# EAGLE design Reaccion-vRegvC (EAGLE 7.4.0)
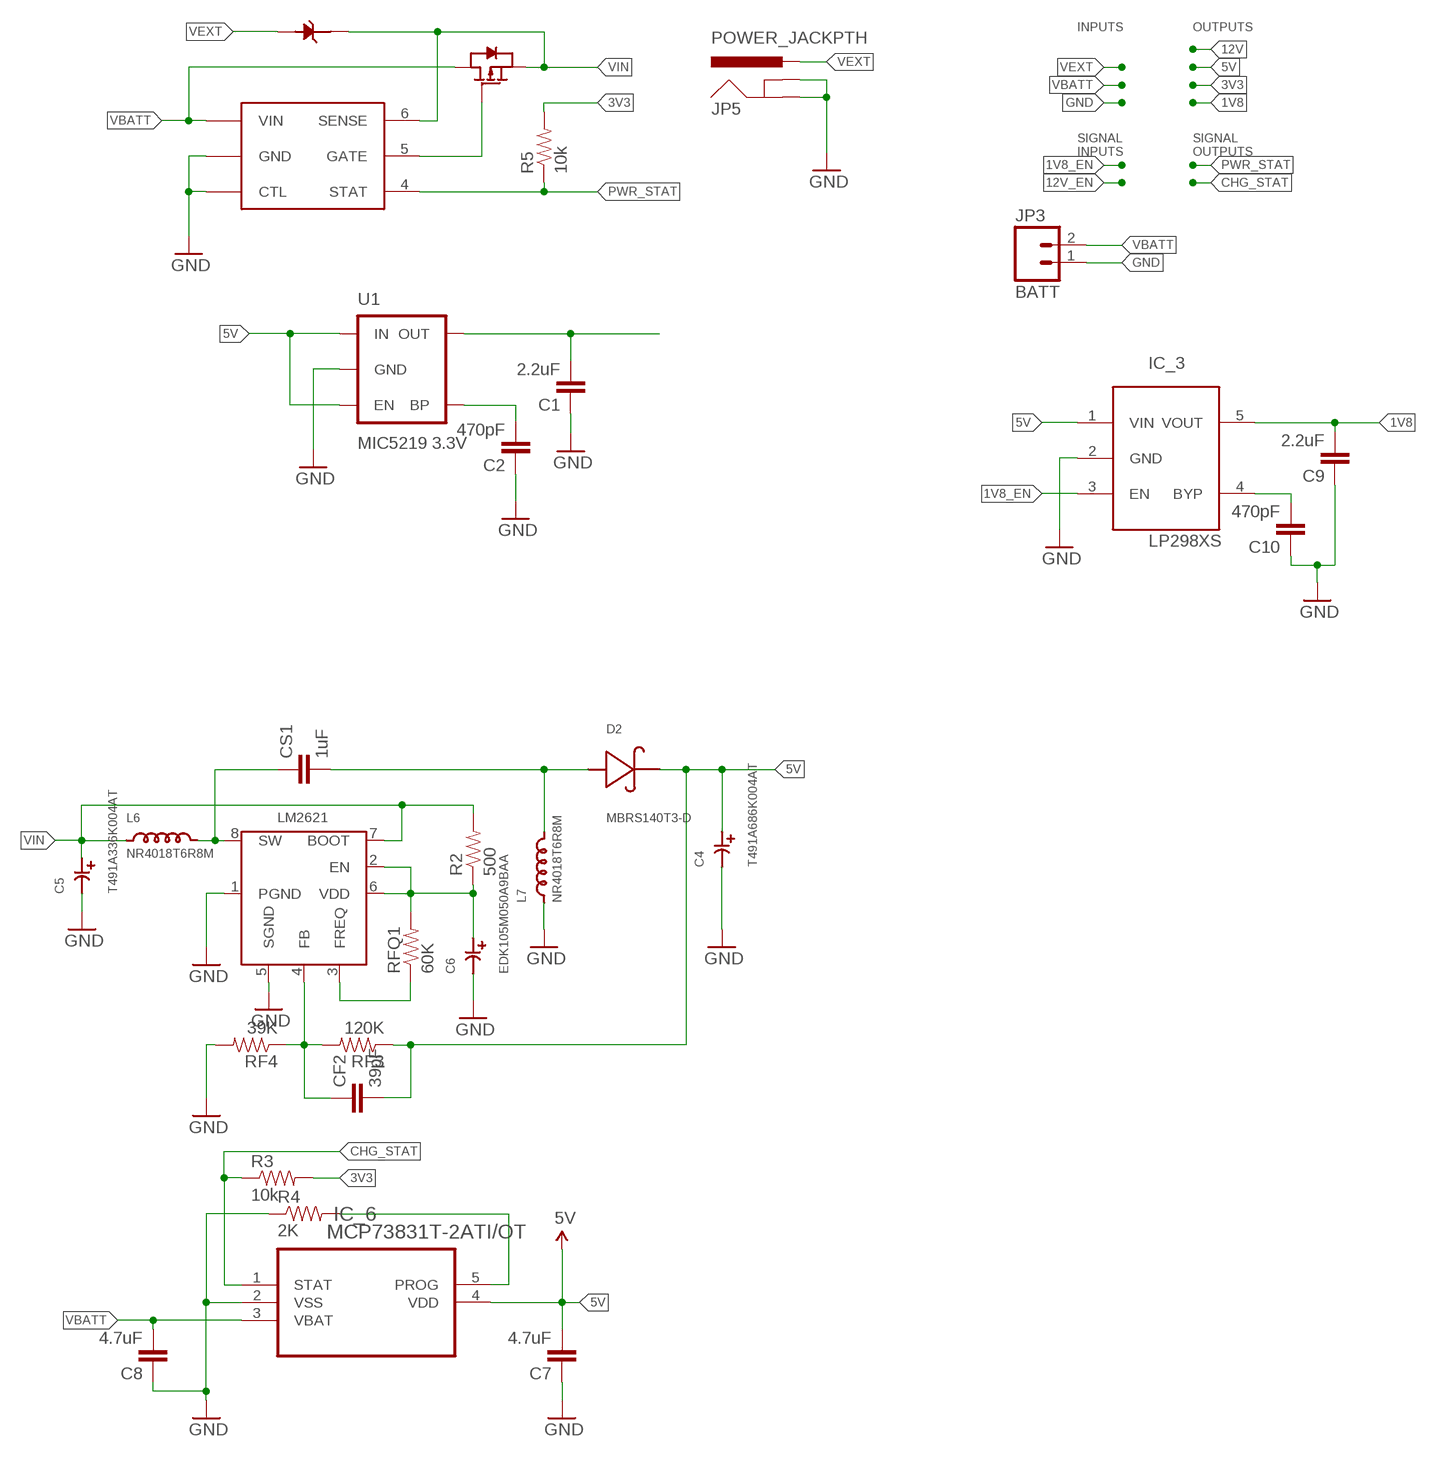
[diagram p0: schematic, sheet 1]

## Parts
C1  2.2uF  CAP0805  [0805]
C2  470pF  CAP0805  [0805]
C4  T491A686K004AT  [3216-18]
C5  T491A336K004AT  [3216-18]
C6  EDK105M050A9BAA  [EDK105M050A9BAA]
C7  4.7uF  CAP0805  [0805]
C8  4.7uF  CAP0805  [0805]
C9  2.2uF  CAP0805  [0805]
C10  470pF  CAP0805  [0805]
CF2  39pF  CAP0805  [0805]
CS1  1uF  CAP0805  [0805]
D2  MBRS140T3-D  [MBRS140T3G]
D4  1N5819HW-7-F  [SOD123]
IC_1  LTC4412  [SOT23-6L]
IC_3  LP298XS  [SOT23-5L]
IC_4  LM2621  [R-PDSO-G8]
IC_6  MCP73831T-2ATI/OT  [SOT95P300X145-5N]
JP3  BATT  M02-JST-2-PTH-NO_SILK  [JST-2-PTH-NS]
JP5  POWER_JACKPTH  [POWER_JACK_PTH]
L6  NR4018T6R8M  [NR4018/NRS4018]
L7  NR4018T6R8M  [NR4018/NRS4018]
Q9  SI2301CDS  [SOT23]
R2  500  RESISTOR0805-RES  [0805]
R3  10k  RESISTOR0805-RES  [0805]
R4  2K  RESISTOR0805-RES  [0805]
R5  10k  RESISTOR0805-RES  [0805]
RF3  120K  RESISTOR0805-RES  [0805]
RF4  39K  RESISTOR0805-RES  [0805]
RFQ1  60K  RESISTOR0805-RES  [0805]
U1  MIC5219 3.3V  V_REG_MIC52193.3V  [SOT23-5]

## Nets
1V8: C9.2 IC_3.5(VOUT)
1V8_EN: IC_3.3(EN)
3V3: C1.2 R3.2 R5.2 U1.5(OUT)
5V: C4.1 C7.2 CF2.2 D2.2 IC_3.1(VIN) IC_6.4(VDD) RF3.1 U1.1(IN) U1.3(EN)
CHG_STAT: IC_6.1(STAT) R3.1
GND: C1.1 C2.1 C4.2 C5.2 C6.P$2 C7.1 C8.1 C9.1 C10.1 IC_1.2(GND) IC_1.3(CTL) IC_3.2(GND) IC_4.1(PGND) IC_4.5(SGND) IC_6.2(VSS) JP3.1 JP5.GND JP5.GNDBREAK L7.P$1 R4.1 RF4.2 U1.2(GND)
N$1: C2.2 U1.4(BP)
N$2: CS1.1 IC_4.8(SW) L6.P$2
N$6: C6.P$1 IC_4.2(EN) IC_4.6(VDD) R2.1 RFQ1.2
N$8: IC_4.3(FREQ) RFQ1.1
N$9: CF2.1 IC_4.4(FB) RF3.2 RF4.1
N$10: CS1.2 D2.1 L7.P$2
N$11: IC_6.5(PROG) R4.2
N$12: IC_1.5(GATE) Q9.1(GATE)
N$13: C10.2 IC_3.4(BYP)
PWR_STAT: IC_1.4(STAT) R5.1
VBATT: C8.2 IC_1.1(VIN) IC_6.3(VBAT) JP3.2 Q9.3(DRAIN)
VEXT: D4.2(ANODE) JP5.PWR
VIN: C5.1 D4.1(CATHODE) IC_1.6(SENSE) IC_4.7(BOOT) L6.P$1 Q9.2(SOURCE) R2.2

## Notes on the sheet
- INPUTS | OUTPUTS
- SIGNAL
  INPUTS
- SIGNAL
  OUTPUTS

## Library data of the parts
C1 C2 C7-C10 CF2 CS1 = SparkFun-Capacitors:CAP: Capacitor Standard 0603 ceramic capacitor, and 0.1" leaded capacitor.
C4 = custom_componentsv0.9:T491A686K004AT
C5 = custom_componentsv0.9:T491A336K004AT
C6 = custom_componentsv0.9:EDK105M050A9BAA
D2 = custom_componentsv0.9:MBRS140T3-D
D4 = custom_components:1N5819HW-7-F
IC_1 = custom_components:LTC4412
IC_3 = adafruit:LP298X
IC_4 = custom_componentsv0.9:LM2621
IC_6 = custom_components:MCP73831T-2ATI/OT: IC, BATT CHARGER, Li-Ion Li-Polymer, 500 mA; MPN: MCP73831T-2ATI/OT; OC_FARNELL: 1834890; OC_NEWARK: 84R5196; PACKAGE: SOT23-5; SUPPLIER: Microchip
JP3 = SparkFun-Connectors:M02: Standard 2-pin 0.1" header. Use with - straight break away headers ( PRT-00116) - right angle break away headers (PRT-00553) - swiss pins (PRT-00743) - machine pins (PRT-00117) - female headers (PRT-00115) Molex polarized connector foot print use with: PRT-08233 with associated crimp pins and housings. 2.54_SCREWTERM for use with PRT-10571. 3.5mm Screw Terminal footprints for PRT-08084 5mm Screw Terminal footprints for use with PRT-08432
JP5 = SparkFun-Connectors:POWER_JACK: Power Jack This is the standard 5.5mm barrel jack for power. The PTH is the most common, proven, reliable, footprint. The Slot footprint only works if the mill layer is transmitted to the PCB fab house so be warned. Mating wall wart : TOL-00298 (and others); PROD_ID: CONN-08197
L6 L7 = custom_componentsv0.9:NR4018T6R8M
Q9 = custom_components:SI2301CDS
R2-R5 RF3 RF4 RFQ1 = SparkFun-Resistors:RESISTOR: Resistor Basic schematic elements and footprints for 0603, 1206, and PTH resistors.
U1 = SparkFun-PowerIC:V_REG_MIC5219: V_REG MIC5219 Standard 500mA LDO voltage regulator in SOT-23 layout. Micrel part MIC5219. BP (by-pass) pin is used to lower output noise with 470pF cap, may be left open.; PROD_ID: VREG-09872

## Net classes
0 default: clearance 0.205 mm

## Board
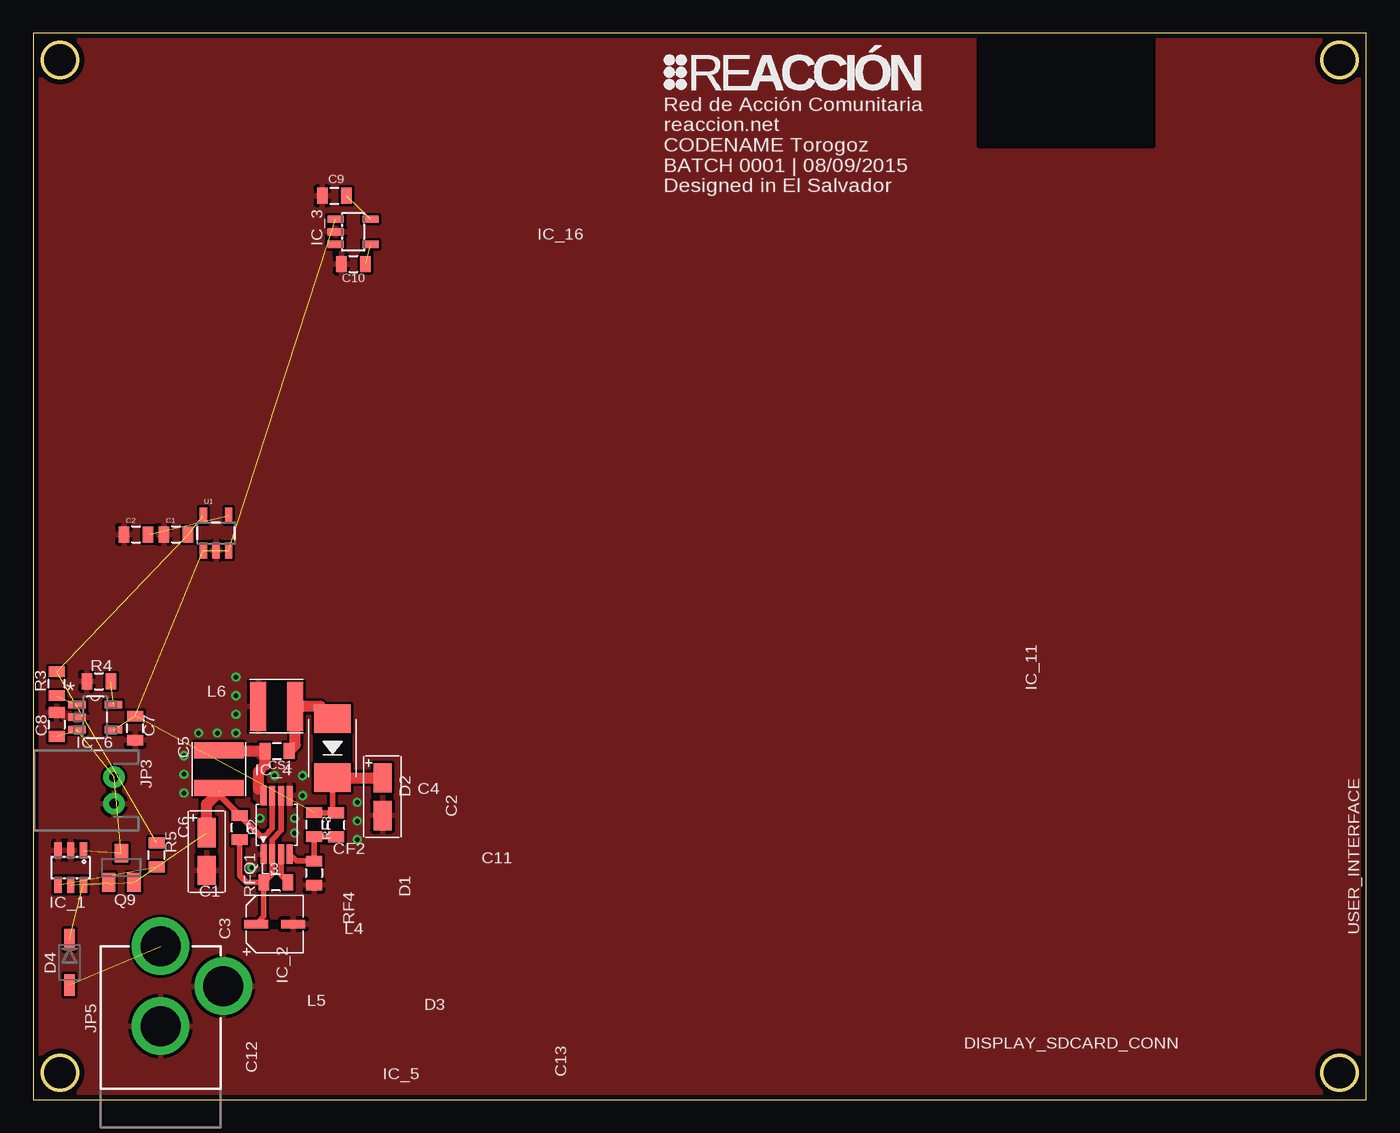
[diagram p1: board, top side]
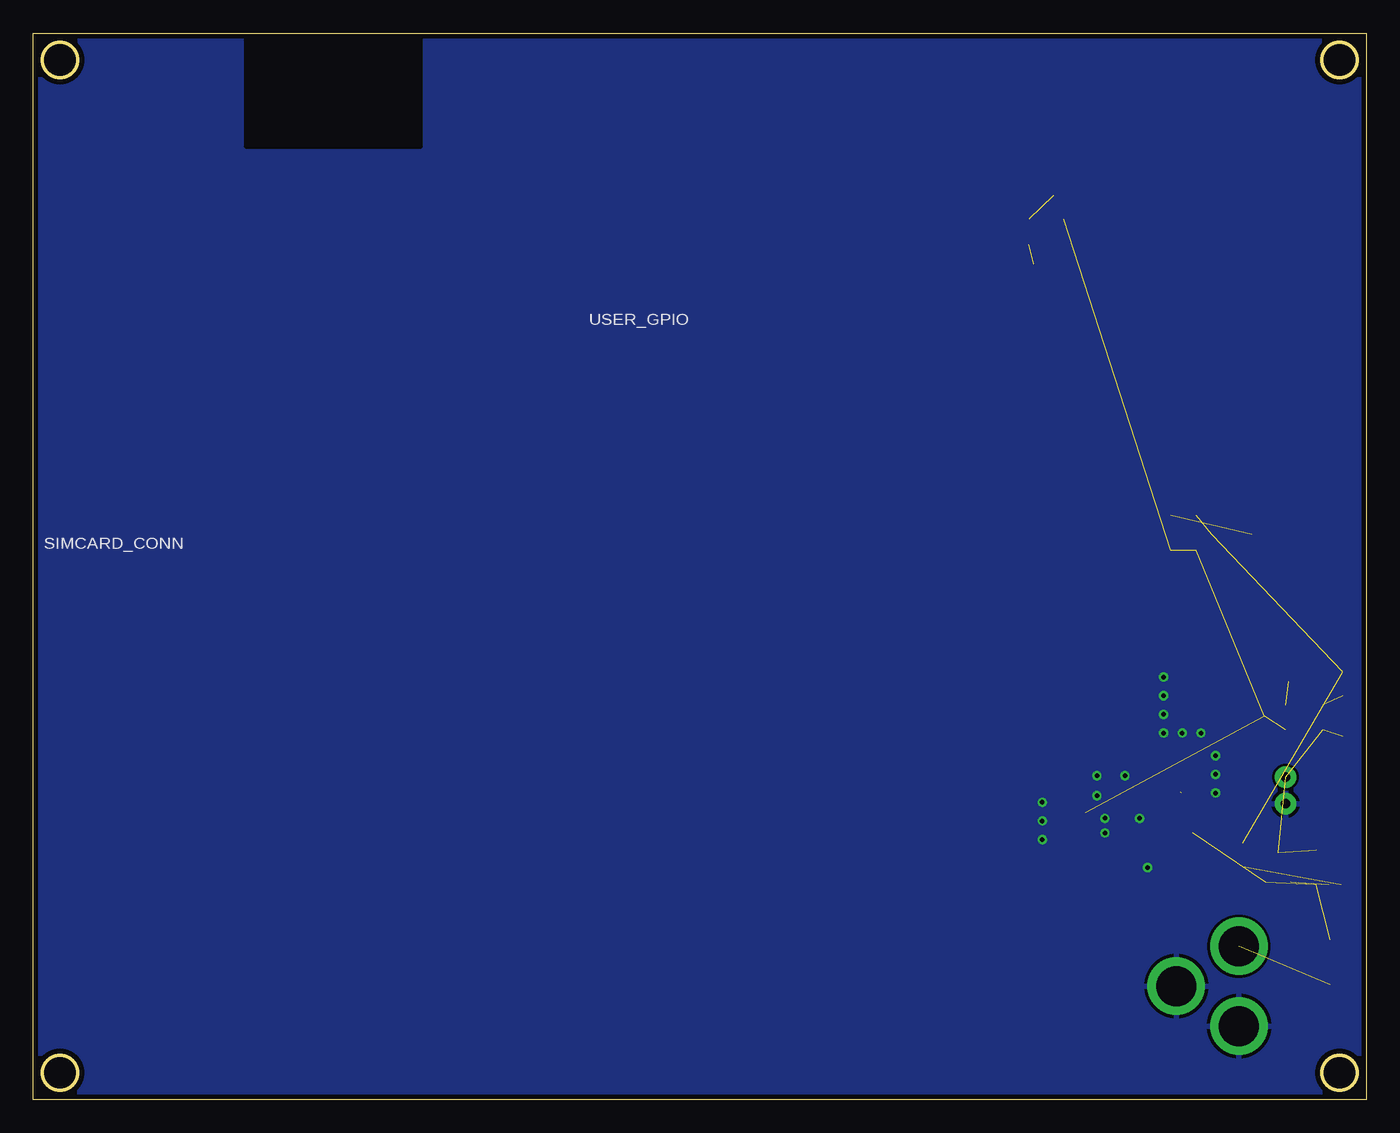
[diagram p2: board, bottom side, seen from below]

Size 100 x 80 mm. Coordinates in mm from the lower left corner, seen from the top.
Outline: 0,0 100,0 100,80 0,80 0,0
Outline: circle at 2,78 radius 1.3
Outline: circle at 98,78 radius 1.3
Outline: circle at 98,2 radius 1.3
Outline: circle at 2,2 radius 1.3
Copper layers (1*16): Top 0.0356mm / dielectric 1.5011mm / Bottom 0.0356mm
Design rules "LaenPCBOrder": minimum track width 6mil, minimum drill 13mil, track to track 6mil, track to pad 6mil, pad to pad 6mil, via to via 6mil, smd to smd 6mil, copper to edge 15mil, drill to drill 6mil, minimum pad ring 7mil, minimum via ring 7mil, stop-mask expansion 3mil, vias tented up to drill 0mil, thermal gap 10mil
tRestrict: area 71,71.6 to 84,80; area 20.4,20.2 to 23.4,21.2; area 21,25.1 to 23.9,27.6; area 17.7,15.6 to 18.7,16.9; area 20.4,16.4 to 21.7,17.5; area 17.6,12.8 to 18.6,13.5; area 14.8,19.8 to 16.2,20.9; area 12,24.1 to 15.9,25.6; area 17.5,27.6 to 19,31.5; area 17.9,25.5 to 18.8,26.8
bRestrict: area 71,71.5 to 84,80

### Footprints (pad centres in the part's own frame; a part is rotated, then mirrored left to right if it is on the bottom)
0805 = smd 0.8 x 1.2: 1 -0.9,0; 2 0.9,0
3216-18 = smd 2.2 x 1.35: 1 1.41,0; 2 -1.41,0
EDK105M050A9BAA = smd 1.8 x 0.65: P$1 1.4,0; P$2 -1.4,0
MBRS140T3G = smd 2.159 x 2.743: 1 2.21,0; 2 -2.21,0
SOD123 = smd 1.6 x 0.8: 1 -1.7,0; 2 1.7,0
SOT23-6L = smd 0.55 x 1.2: 1 -0.95,-1.3; 2 0,-1.3; 3 0.95,-1.3; 4 0.95,1.3; 5 0,1.3; 6 -0.95,1.3
SOT23-5L = smd 0.55 x 1.2: 1 -0.95,-1.3; 2 0,-1.3; 3 0.95,-1.3; 4 0.95,1.3; 5 -0.95,1.3
R-PDSO-G8 = smd 0.45 x 1.45: 1 -0.975,-2.2; 2 -0.325,-2.2; 3 0.325,-2.2; 4 0.975,-2.2; 5 0.975,2.2; 6 0.325,2.2; 7 -0.325,2.2; 8 -0.975,2.2
SOT95P300X145-5N = smd 1.321 x 0.559: 1 -1.372,0.94; 2 -1.372,0; 3 -1.372,-0.94; 4 1.372,-0.94; 5 1.372,0.94
JST-2-PTH-NS = drill 0.7 pad 1.6: 1 -1,0; 2 1,0
POWER_JACK_PTH = drill 2.997 pad 4.318: GND 0,7.7; GNDBREAK 4.7,10.7; PWR 0,13.7
NR4018/NRS4018 = smd 1.2 x 3.7: P$1 -1.4,0; P$2 1.4,0
SOT23 = smd 1 x 1.4: 1 -0.95,-1.1; 2 0.95,-1.1; 3 0,1.1
SOT23-5 = smd 0.55 x 1.2: 1 -0.95,-1.3; 2 0,-1.3; 3 0.95,-1.3; 4 0.95,1.3; 5 -0.95,1.3

### Placement (x,y rotation side)
C1  10.7,42.4 0 top
C2  7.7,42.4 0 top
C4  26.19,22.72 90 top
C5  13,18.6 90 top
C6  18.11,13.16 180 top
C7  7.63,27.87 90 top
C8  1.75,28.14 270 top
C9  22.59,67.82 0 top
C10  24.02,62.7 0 top
CF2  22.72,20.6 90 top
CS1  18.29,26.15 0 top
D2  22.45,26.36 90 top
D4  2.7,10.3 270 top
IC_1  2.8,17.4 180 top
IC_3  23.99,65.1 270 top
IC_4  18.26,20.61 0 top
IC_6  4.64,28.68 0 top
JP3  6.05,23.19 90 top
JP5  9.55,-2.19 0 top
L6  13.93,24.78 90 top
L7  18.25,29.5 0 top
Q9  6.6,17.4 0 top
R2  15.49,20.4 90 top
R3  1.75,31.2 90 top
R4  4.92,31.37 0 top
R5  9.25,18.35 90 top
RF3  21.09,20.63 270 top
RF4  21.06,16.99 270 top
RFQ1  18.19,16.29 180 top
U1  13.7,42.5 0 top

### Tracks (layer width: path | path; a pad name or v marks a point on that pad's centre or on a via)
1V8  (1 unrouted)
3V3  (3 unrouted)
5V  (5 unrouted)
  Top 0.406: D2.2 22.45,21.78 CF2.2 21.12,21.5 RF3.1
  Top 0.813: 22.47,24.13 C4.1
  Top 1.016: D2.2 22.47,24.13
CHG_STAT  (1 unrouted)
GND  (via drill 0.33)
  other vias: 17,21.1 16.4,17.4 12.4,27.5 13.8,27.5 15.2,27.5 18.1,24.3 20.2,24.3 20.2,22.8 19.6,21.1 19.6,20 15.2,28.9 15.2,30.3 15.2,31.7 24.3,22.3 24.3,20.9 24.3,19.5 11.3,23 11.3,24.4 11.3,25.8
  pour Top (rank 2): 0,0 99.95,0 99.95,79.94 0,79.94
  pour Bottom (rank 2): 0,0 100.19,0 100.19,80.03 0.13,80.03
N$1  (1 unrouted)
N$2
  Top 0.406: 16.9,23.3 17.28,22.92 IC_4.8
  Top 0.813: L6.P$2 14.26,26.15 CS1.1 17.4,25.1 16.9,24.6 16.9,23.3
  pour Top (no thermals): 17.1,22.2 16.6,22.6 16.6,23.4 17.4,23.4 17.4,22.2
  pour Top (no thermals): 16.6,25.9 17.1,25.4 17.6,25.4 17.6,26.3 16.6,26.3
N$6
  Top 0.406: C6.P$1 17.29,13.74 RFQ1.2 | RFQ1.2 17.93,16.93 IC_4.2 17.9,18.44 17.9,19.5 18.58,20.18 IC_4.6 | R2.1 15.49,16.81 16,16.3 RFQ1.2
N$8
  Top 0.406: RFQ1.1 18.58,16.8 IC_4.3
N$9
  Top 0.406: IC_4.4 19.75,17.89 RF4.1 21.06,19.71 RF3.2 21.12,19.7 CF2.1
N$10
  Top 0.813: CS1.2 19.65,26.61 L7.P$2 21.52,29.5 D2.1
N$11  (1 unrouted)
N$12  (1 unrouted)
N$13  (1 unrouted)
PWR_STAT  (1 unrouted)
VBATT  (4 unrouted)
VEXT  (1 unrouted)
VIN  (4 unrouted)
  Top 0.406: IC_4.7 17.93,20.33 17.4,19.8 17,19.8 16.6,20.2 16.59,20.2 R2.2 13.87,22.91 13.87,23.03
  Top 0.813: C5.1 13,22.15 13.93,23.08 L6.P$1

### Text on the board
tNames: Red de Acción Comunitaria / reaccion.net / CODENAME Torogoz / BATCH 0001 | 08/09/2015 / Designed in El Salvador | IC_16 | IC_11 | L6 | C5 | IC_4 | D2 | C4 | C2 | C6 | C11 | L3 | C1 | D1 | C3 | L4 | USER_INTERFACE | IC_2 | L5 | D3 | DISPLAY_SDCARD_CONN | C12 | IC_5 | C13
bNames: USER_GPIO | SIMCARD_CONN